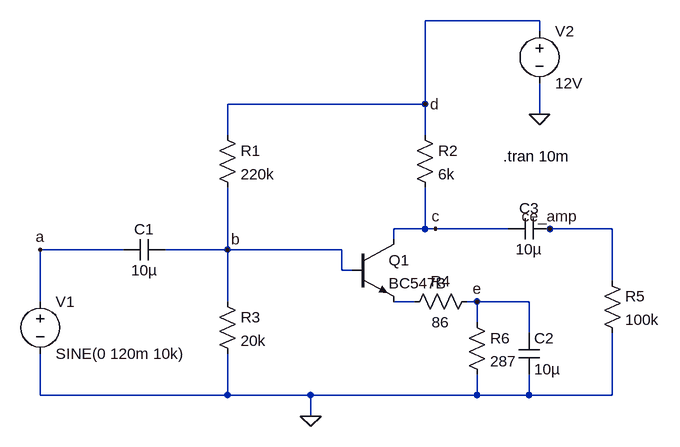
[diagram p0: schematic 2nd_Stage_Gain.asc]
2nd_Stage_Gain.asc, the LTspice schematic file:
Version 4
SHEET 1 1760 756
WIRE 640 -80 464 -80
WIRE 640 -64 640 -80
WIRE 464 48 464 -80
WIRE 464 48 160 48
WIRE 640 64 640 16
WIRE 160 96 160 48
WIRE 464 96 464 48
WIRE 464 240 464 176
WIRE 464 240 416 240
WIRE 480 240 464 240
WIRE 592 240 480 240
WIRE 656 240 640 240
WIRE 752 240 656 240
WIRE 416 256 416 240
WIRE 0 272 -128 272
WIRE 160 272 160 176
WIRE 160 272 64 272
WIRE 336 272 160 272
WIRE 336 304 336 272
WIRE 352 304 336 304
WIRE 752 320 752 240
WIRE -128 352 -128 272
WIRE 160 352 160 272
WIRE 448 352 416 352
WIRE 544 352 528 352
WIRE 624 352 544 352
WIRE 544 384 544 352
WIRE 624 400 624 352
WIRE -128 496 -128 432
WIRE 160 496 160 432
WIRE 160 496 -128 496
WIRE 288 496 160 496
WIRE 544 496 544 464
WIRE 544 496 288 496
WIRE 624 496 624 464
WIRE 624 496 544 496
WIRE 752 496 752 400
WIRE 752 496 624 496
WIRE 288 528 288 496
FLAG 288 528 0
FLAG 640 64 0
FLAG 656 240 ce_amp
FLAG -128 272 a
FLAG 160 272 b
FLAG 480 240 c
FLAG 464 48 d
FLAG 544 352 e
SYMBOL res 144 80 R0
SYMATTR InstName R1
SYMATTR Value 220k
SYMBOL cap 64 256 R90
WINDOW 0 0 32 VBottom 2
WINDOW 3 32 32 VTop 2
SYMATTR InstName C1
SYMATTR Value 10µ
SYMBOL res 448 80 R0
SYMATTR InstName R2
SYMATTR Value 6k
SYMBOL cap 608 400 R0
SYMATTR InstName C2
SYMATTR Value 10µ
SYMBOL cap 656 224 R90
WINDOW 0 0 32 VBottom 2
WINDOW 3 32 32 VTop 2
SYMATTR InstName C3
SYMATTR Value 10µ
SYMBOL res 144 336 R0
SYMATTR InstName R3
SYMATTR Value 20k
SYMBOL voltage -128 336 R0
WINDOW 123 0 0 Left 0
WINDOW 39 0 0 Left 0
SYMATTR InstName V1
SYMATTR Value SINE(0 120m 10k)
SYMBOL voltage 640 -80 R0
WINDOW 123 0 0 Left 0
WINDOW 39 0 0 Left 0
SYMATTR InstName V2
SYMATTR Value 12V
SYMBOL npn 352 256 R0
SYMATTR InstName Q1
SYMATTR Value BC547B
SYMBOL res 736 304 R0
SYMATTR InstName R5
SYMATTR Value 100k
SYMBOL res 528 368 R0
SYMATTR InstName R6
SYMATTR Value 287
SYMBOL res 544 336 R90
WINDOW 0 0 56 VBottom 2
WINDOW 3 32 56 VTop 2
SYMATTR InstName R4
SYMATTR Value 86
TEXT 584 128 Left 2 !.tran 10m

The netlist it stands for:
* 2nd_Stage_Gain.asc
R1 d b 220k
C1 b a 10µ
R2 d c 6k
C2 e 0 10µ
C3 ce_amp c 10µ
R3 b 0 20k
V1 a 0 SINE(0 120m 10k)
V2 d 0 12V
Q1 c b N001 0 BC547B
R5 ce_amp 0 100k
R6 e 0 287
R4 e N001 86
.model NPN NPN
.model PNP PNP
.lib standard.bjt
.tran 10m
.backanno
.end